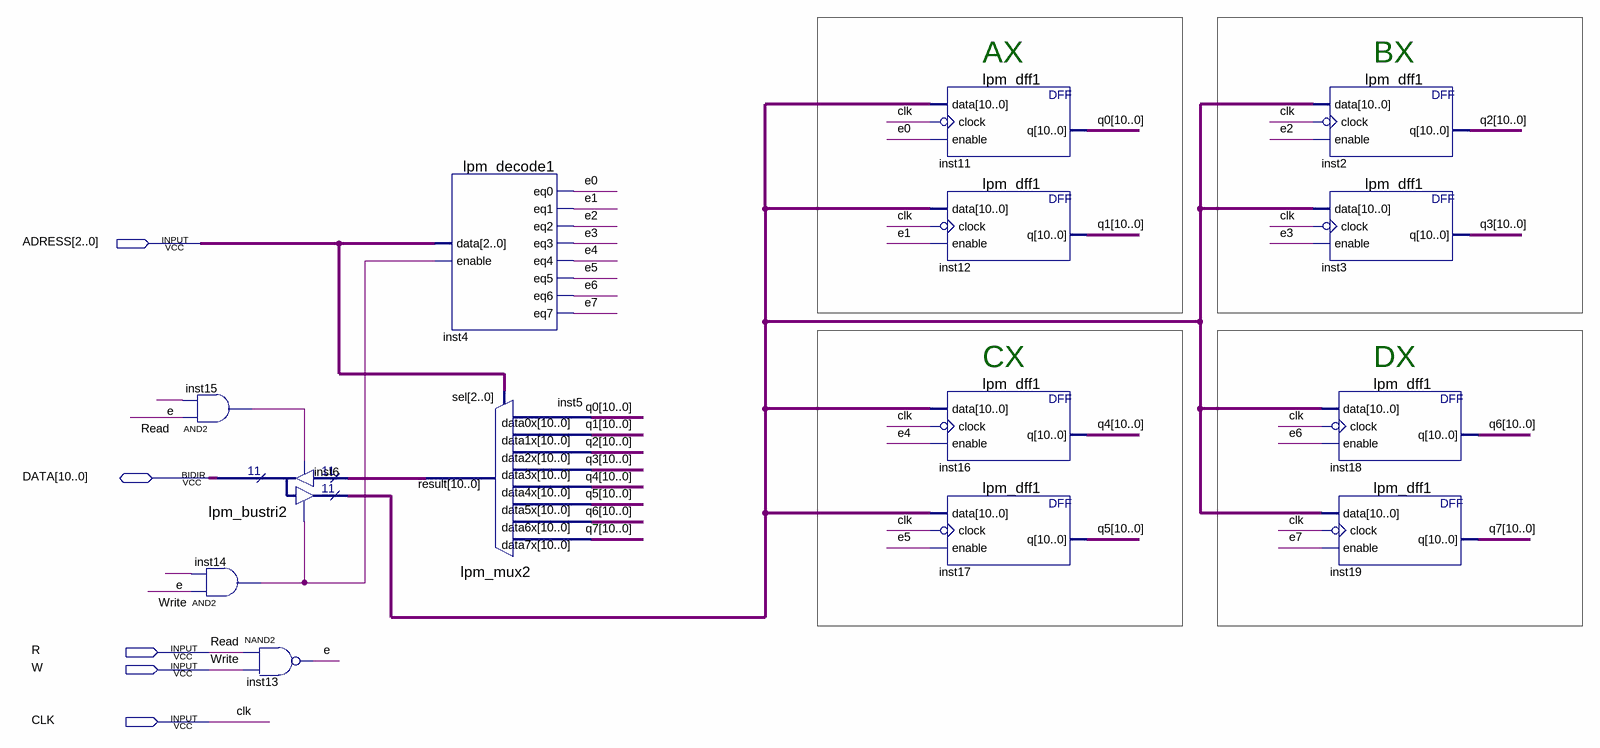
[diagram p0: schematic sheet]
// Quartus schematic RON.bdf as structural Verilog: 14 symbols, 5 pins
module RON (
  input  [2:0] ADRESS,
  input  R,
  input  W,
  input  CLK,
  inout  [10:0] DATA
);

  wire e, e0, e1, e2, e3, e4, e5, e6, e7, inst14_out, inst15_out;
  wire [10:0] inst5_result, inst6_result, q0, q1, q2, q3, q4, q5, q6, q7;

  and inst15 (inst15_out, R, e);
  and inst14 (inst14_out, W, e);
  lpm_bustri2 inst6 (
    .enabledt(inst15_out), .data(inst5_result), .enabletr(inst14_out), .result(inst6_result), .tridata(DATA));
  nand inst13 (e, R, W);
  lpm_decode1 inst4 (
    .data(ADRESS), .enable(inst14_out), .eq0(e0), .eq1(e1), .eq2(e2), .eq3(e3), .eq4(e4), .eq5(e5), .eq6(e6),
    .eq7(e7));
  lpm_mux2 inst5 (
    .data7x(q7), .data6x(q6), .data5x(q5), .data4x(q4), .data3x(q3), .data2x(q2), .data1x(q1), .data0x(q0),
    .sel(ADRESS), .result(inst5_result));
  lpm_dff1 inst11 (.data(inst6_result), .clock(~CLK), .enable(e0), .q(q0));
  lpm_dff1 inst12 (.data(inst6_result), .clock(~CLK), .enable(e1), .q(q1));
  lpm_dff1 inst16 (.data(inst6_result), .clock(~CLK), .enable(e4), .q(q4));
  lpm_dff1 inst17 (.data(inst6_result), .clock(~CLK), .enable(e5), .q(q5));
  lpm_dff1 inst2 (.data(inst6_result), .clock(~CLK), .enable(e2), .q(q2));
  lpm_dff1 inst3 (.data(inst6_result), .clock(~CLK), .enable(e3), .q(q3));
  lpm_dff1 inst18 (.data(inst6_result), .clock(~CLK), .enable(e6), .q(q6));
  lpm_dff1 inst19 (.data(inst6_result), .clock(~CLK), .enable(e7), .q(q7));

  // Other names for the same wires on the sheet: Read = R; Write = W

  // Notes on the sheet:
  //   AX
  //   BX
  //   CX
  //   DX
endmodule
